# Altium project IRNAS_Fuel gauge.PrjPcb
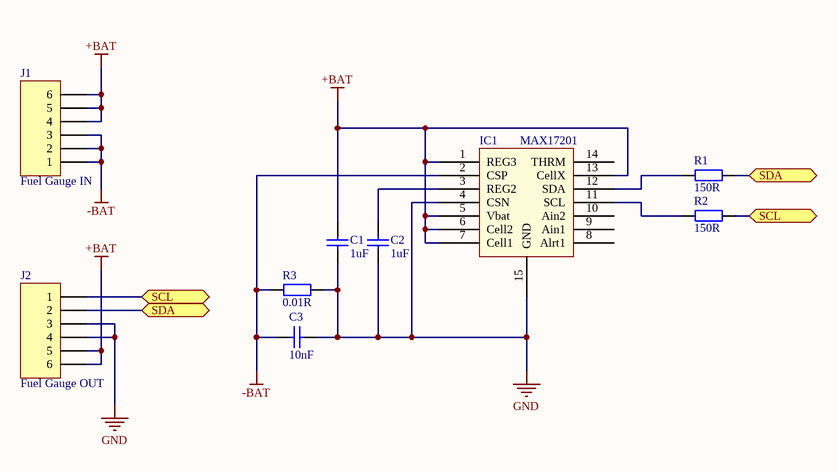
[diagram p0: Fuel gauge.SchDoc]
1 sheet, 9 parts. Net scope: flat (ports and power ports of the same name join across sheets).
Board file: Fuel gauge.PcbDoc

## Sheet Fuel gauge.SchDoc
size A4

### Parts
C1  Valve: 1uF  [0603 cap]  (hidden comment: Capacitor NP)
C2  Valve: 1uF  [0603 cap]  (hidden comment: Capacitor NP)
C3  Valve: 10nF  [0603 cap]  (hidden comment: Capacitor NP)
IC1  MAX17201  [TDFN14]
J1  Fuel Gauge IN  [HDR1X6]
J2  Fuel Gauge OUT  [HDR1X6]
R1  Valve: 150R  [0603 RES]  (hidden comment: Resistor generic)
R2  Valve: 150R  [0603 RES]  (hidden comment: Resistor generic)
R3  Valve: 0.01R  [2512 RES]  (hidden comment: Resistor generic)

### Ports
SCL, SDA

### Nets
+BAT: C1.2 IC1.1(REG3) IC1.5(Vbat) IC1.6(Cell2) IC1.7(Cell1) IC1.13(CellX) J1.4 J1.5 J1.6 J2.5 J2.6
-BAT: C3.2 IC1.2(CSP) J1.1 J1.2 J1.3 R3.1
GND: C1.1 C2.1 C3.1 IC1.4(CSN) IC1.15(GND) J2.3 J2.4 R3.2
NetC2_2: C2.2 IC1.3(REG2)
NetIC1_11: IC1.11(SCL) R2.1
NetIC1_12: IC1.12(SDA) R1.1
NetJ2_1: J2.1 R2.2 ; port SCL
NetJ2_2: J2.2 R1.2 ; port SDA

Not connected (* = marked no-connect by the designer): IC1 8(Alrt1) 9(Ain1) 10(Ain2) 14(THRM)

### Library data of the parts
IC1 = MAX17201: Single cell fuel gauge; Valve: *; Supplier 1: Avnet Europe
J1 J2 = Header 6: Header, 6-Pin; LatestRevisionDate: 17-Jul-2002; LatestRevisionNote: Re-released for DXP Platform.; Publisher: Altium Limited
R1-R3 = Resistor: Resistor SMD
C1-C3 = Capacitor NP: Voltage: *